# Altium project PCB_Project.PrjPcb (part 1 of 4)
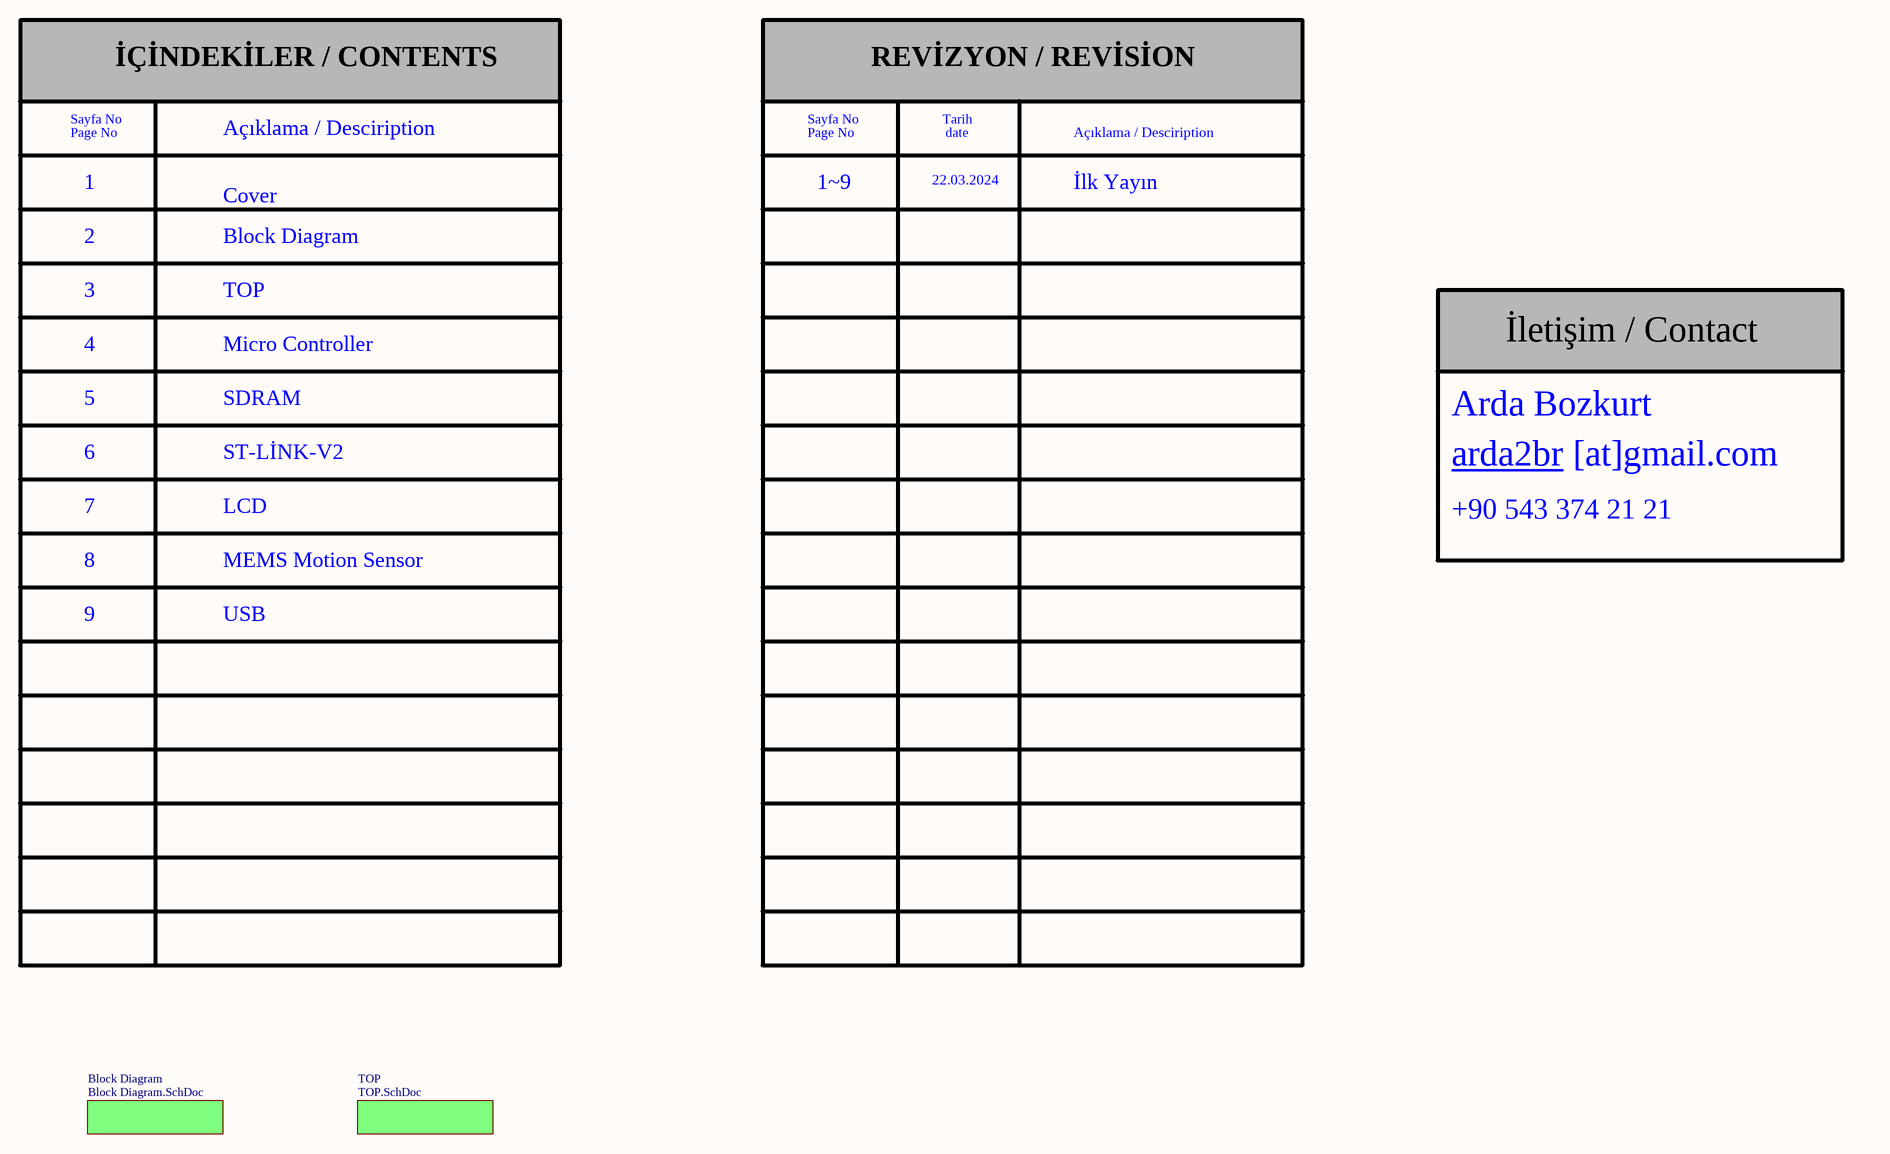
[diagram p0: Cover Page.SchDoc]
9 sheets, 161 parts. Net scope: flat (ports and power ports of the same name join across sheets).
Board file: STM PCB.PcbDoc
Sheets:
  Cover Page.SchDoc
    Block Diagram = Block Diagram.SchDoc
    TOP = TOP.SchDoc
      MCU = Micro Controller.SchDoc
      SDRAM = SDRAM.SchDoc
      ST-LINK = ST-LINK.SchDoc
      LCD = LCD.SchDoc
      MEMS = MEMS Motion Sensor.SchDoc
      USB = USB.SchDoc

## Sheet Cover Page.SchDoc
size 420 x 297 mm; Date: 22.03.2024; ApprovedBy: Arda B.; CheckedBy: Arda B.; DrawnBy: Arda Bozkurt; Revision: 001; SheetNumber: 1; SheetTotal: 9; Size: A3; Department: HDD; DOC_NO_ASSY_: __; Time: 22.03.2024

### Sub-sheets
Block Diagram = Block Diagram.SchDoc: no entries
TOP = TOP.SchDoc: no entries

### Notes on the sheet
- İÇİNDEKİLER / CONTENTS
- REVİZYON / REVİSİON
- Page No
- Sayfa No
- Açıklama / Desciription
- 22.03.2024
- Tarih
- date
- 1
- 2
- Cover
- Block Diagram
- 1~9
- İlk Yayın
- 3
- TOP
- 4
- Micro Controller
- İletişim / Contact
- 5
- SDRAM
- Arda Bozkurt
- 6
- 7
- ST-LİNK-V2
- LCD
- arda2br
- [at]gmail.com
- 8
- MEMS Motion Sensor
- +90 543 374 21 21
- 9
- USB
- REVİSİON
- DESCRIPTION
- DATE
- APPROVED
- DWG NO:
- TAINIM/DESCRIPTION
- REV:
- DOSYA ADI/FİLE NAME
- HAZIRLAYAN/PREPARED BY
- KONTROL EDEN/ CHECKED BY
- YAYIN TARİHİ/REL. DATE
- DEĞ TARİHİ/CHANCE DATE
- ONAYLAYAN/APPROVED BY
- REVİZYON/REVISION
- BÖLÜM/DEPARTMENT
- BOYUT/SİZE
- SAYFA/SHEET
- of

## Sheet Block Diagram.SchDoc
size 420 x 297 mm; Date: 22.03.2024; ApprovedBy: Arda B.; CheckedBy: Arda B.; DrawnBy: Arda Bozkurt; Revision: 001; SheetNumber: 2; SheetTotal: 9; Size: A3; Department: HDD; DOC_NO_ASSY_: __; Time: 22.03.2024
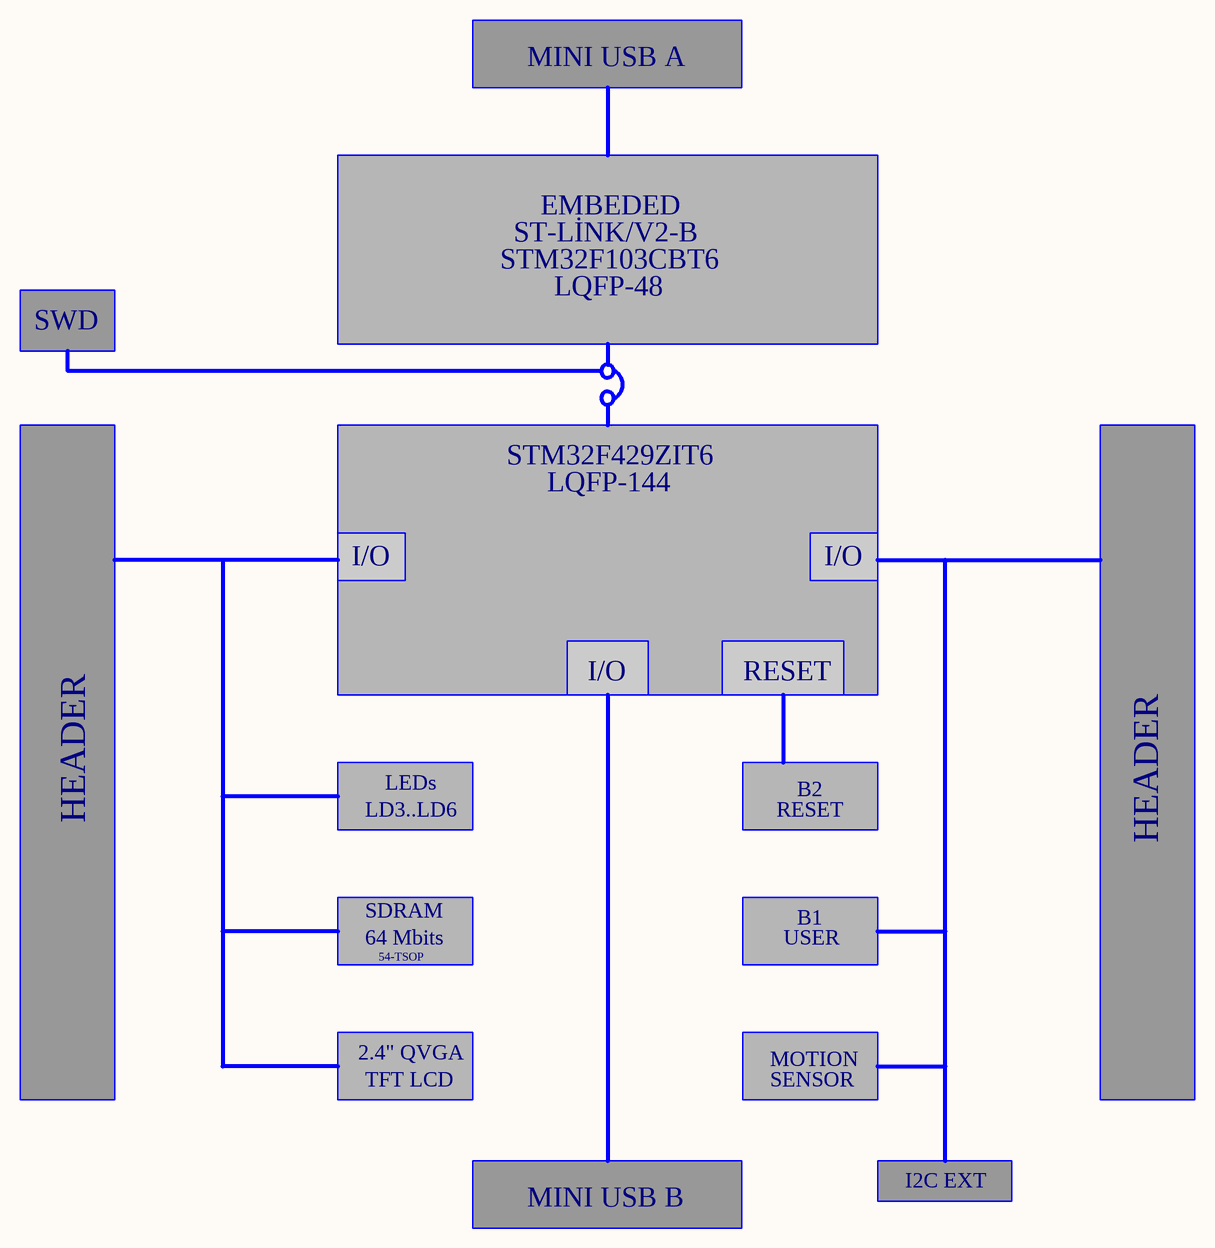
[diagram p1: Block Diagram.SchDoc]

### Notes on the sheet
- MINI USB A
- ST-LİNK/V2-B
- EMBEDED
- STM32F103CBT6
- LQFP-48
- SWD
- STM32F429ZIT6
- LQFP-144
- I/O
- RESET
- HEADER
- LD3..LD6
- LEDs
- B2
- SDRAM
- 64 Mbits
- 54-TSOP
- USER
- B1
- 2.4" QVGA
- TFT LCD
- MOTION
- SENSOR
- I2C EXT
- MINI USB B
- REVİSİON
- DESCRIPTION
- DATE
- APPROVED
- DWG NO:
- TAINIM/DESCRIPTION
- REV:
- DOSYA ADI/FİLE NAME
- HAZIRLAYAN/PREPARED BY
- KONTROL EDEN/ CHECKED BY
- YAYIN TARİHİ/REL. DATE
- DEĞ TARİHİ/CHANCE DATE
- ONAYLAYAN/APPROVED BY
- REVİZYON/REVISION
- Arda Bozkurt
- BÖLÜM/DEPARTMENT
- BOYUT/SİZE
- SAYFA/SHEET
- of

## Sheet TOP.SchDoc
size 420 x 297 mm; Date: 22.03.2024; ApprovedBy: Arda B.; CheckedBy: Arda B.; DrawnBy: Arda Bozkurt; Revision: 001; SheetNumber: 3; SheetTotal: 9; Size: A3; Department: HDD; DOC_NO_ASSY_: __; Time: 22.03.2024
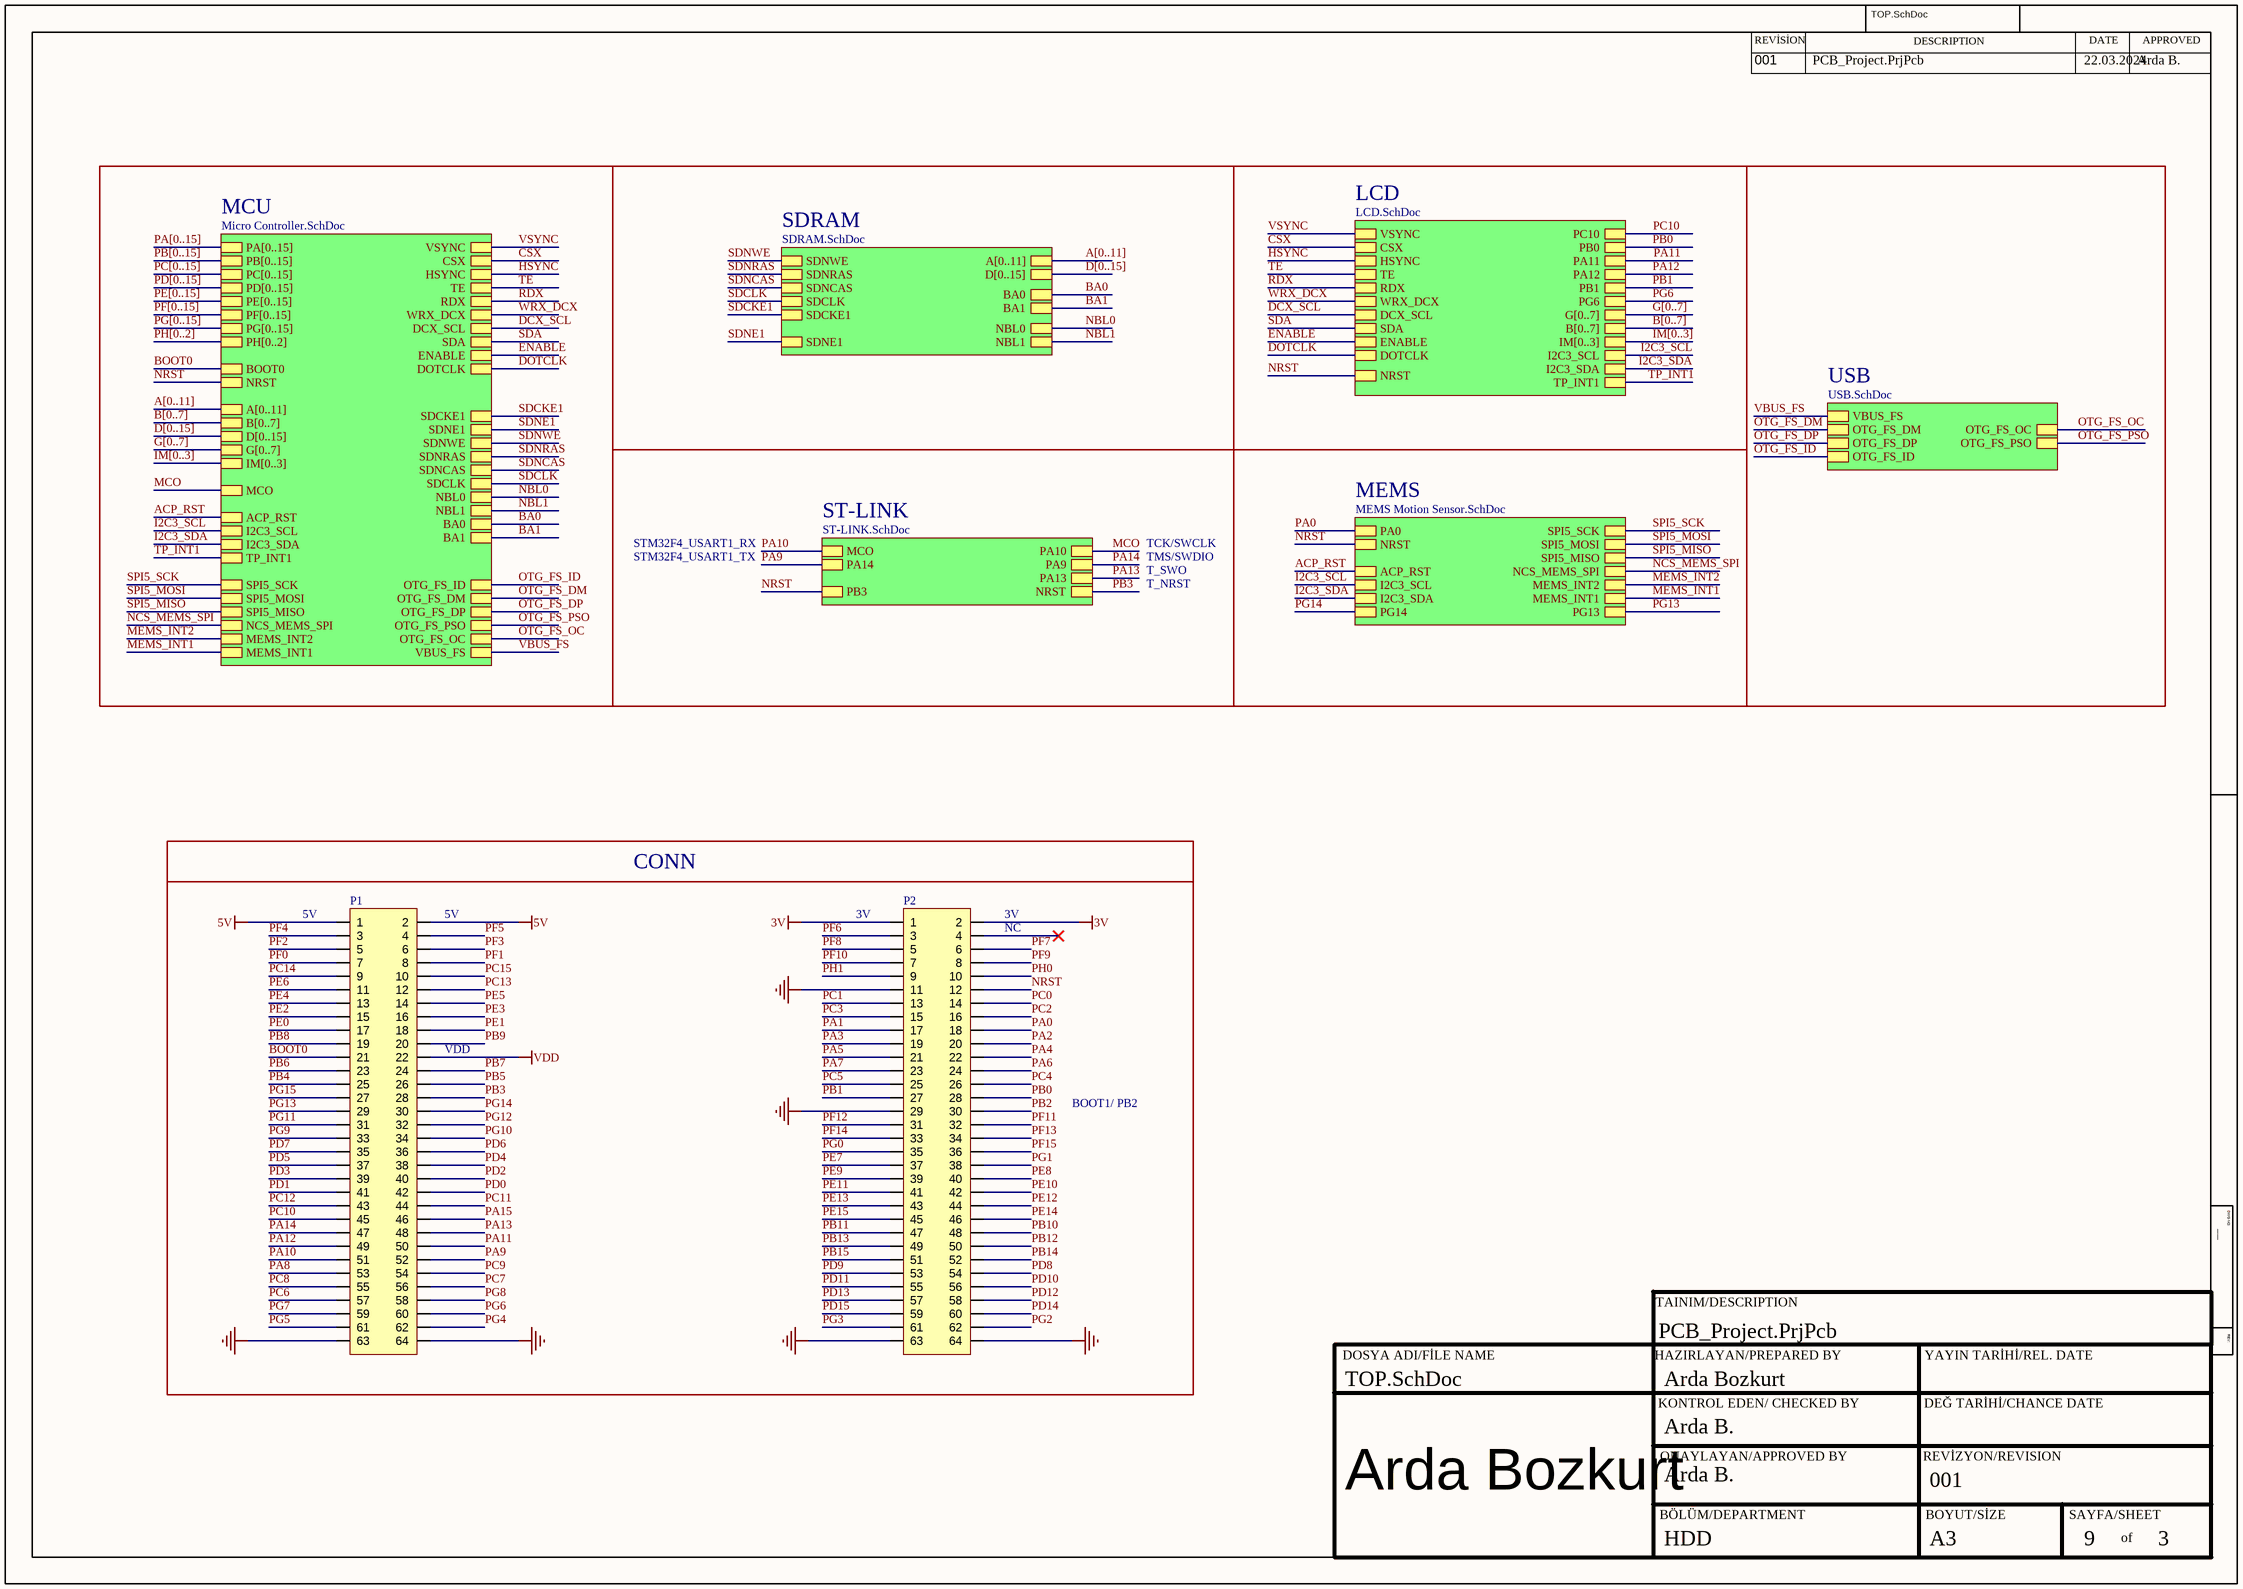
[diagram p2: TOP.SchDoc]

### Parts
P1  TSW-132-24-T-D  [CONN-2*32POS]  (value not drawn)
P2  TSW-132-24-T-D  [CONN-2*32POS]  (value not drawn)

### Blocks framed on the sheet
CONN: P1 P2

### Sub-sheets
LCD = LCD.SchDoc: PC10, PB0, PA11, PA12, PB1, PG6, G[0..7], B[0..7], IM[0..3], I2C3_SCL, I2C3_SDA, TP_INT1, NRST, VSYNC, CSX, HSYNC, TE, RDX, WRX_DCX, DCX_SCL, SDA, ENABLE, DOTCLK
MCU = Micro Controller.SchDoc: PA[0..15], PB[0..15], PC[0..15], PD[0..15], PE[0..15], PF[0..15], PG[0..15], PH[0..2], BOOT0, NRST, A[0..11], B[0..7], D[0..15], G[0..7], IM[0..3], MCO, ACP_RST, I2C3_SCL, I2C3_SDA, TP_INT1, VSYNC, CSX, HSYNC, TE, RDX, WRX_DCX, DCX_SCL, SDA, ENABLE, DOTCLK, SDCKE1, SDNE1, SDNWE, SDNRAS, SDNCAS, SDCLK, NBL0, NBL1, BA0, BA1, OTG_FS_ID, OTG_FS_DM, OTG_FS_DP, OTG_FS_PSO, OTG_FS_OC, VBUS_FS, SPI5_SCK, SPI5_MOSI, SPI5_MISO, NCS_MEMS_SPI, MEMS_INT2, MEMS_INT1
MEMS = MEMS Motion Sensor.SchDoc: PG13, PA0, NRST, PG14, SPI5_SCK, SPI5_MOSI, SPI5_MISO, NCS_MEMS_SPI, MEMS_INT2, MEMS_INT1, ACP_RST, I2C3_SCL, I2C3_SDA
SDRAM = SDRAM.SchDoc: SDCKE1, SDNE1, SDNWE, SDNRAS, SDNCAS, SDCLK, NBL0, NBL1, BA0, BA1, A[0..11], D[0..15]
ST-LINK = ST-LINK.SchDoc: PA10, PA9, MCO, PA14, PA13, PB3, NRST
USB = USB.SchDoc: VBUS_FS, OTG_FS_DM, OTG_FS_DP, OTG_FS_ID, OTG_FS_OC, OTG_FS_PSO

### Nets
3V: P2.1 P2.2
5V: P1.1 P1.2
GND: P1.63 P1.64 P2.11 P2.29 P2.63 P2.64
VDD: P1.22
ACP_RST: sheet MCU/ACP_RST, sheet MEMS/ACP_RST
BA0: sheet MCU/BA0, sheet SDRAM/BA0
BA1: sheet MCU/BA1, sheet SDRAM/BA1
BOOT0: P1.21 ; sheet MCU/BOOT0
CSX: sheet MCU/CSX, sheet LCD/CSX
DCX_SCL: sheet MCU/DCX_SCL, sheet LCD/DCX_SCL
DOTCLK: sheet MCU/DOTCLK, sheet LCD/DOTCLK
ENABLE: sheet MCU/ENABLE, sheet LCD/ENABLE
HSYNC: sheet MCU/HSYNC, sheet LCD/HSYNC
I2C3_SCL: sheet MCU/I2C3_SCL, sheet LCD/I2C3_SCL, sheet MEMS/I2C3_SCL
I2C3_SDA: sheet MCU/I2C3_SDA, sheet LCD/I2C3_SDA, sheet MEMS/I2C3_SDA
MCO: sheet MCU/MCO, sheet ST-LINK/PA10
MEMS_INT1: sheet MCU/MEMS_INT1, sheet MEMS/MEMS_INT1
MEMS_INT2: sheet MCU/MEMS_INT2, sheet MEMS/MEMS_INT2
NBL0: sheet MCU/NBL0, sheet SDRAM/NBL0
NBL1: sheet MCU/NBL1, sheet SDRAM/NBL1
NCS_MEMS_SPI: sheet MCU/NCS_MEMS_SPI, sheet MEMS/NCS_MEMS_SPI
NRST: P2.12 ; sheet MCU/NRST, sheet ST-LINK/PB3, sheet LCD/NRST, sheet MEMS/NRST
OTG_FS_DM: sheet MCU/OTG_FS_DM, sheet USB/OTG_FS_DM
OTG_FS_DP: sheet MCU/OTG_FS_DP, sheet USB/OTG_FS_DP
OTG_FS_ID: sheet MCU/OTG_FS_ID, sheet USB/OTG_FS_ID
OTG_FS_OC: sheet MCU/OTG_FS_OC, sheet USB/OTG_FS_OC
OTG_FS_PSO: sheet MCU/OTG_FS_PSO, sheet USB/OTG_FS_PSO
PA0: P2.18 ; sheet MEMS/PA0
PA1: P2.17
PA2: P2.20
PA3: P2.19
PA4: P2.22
PA5: P2.21
PA6: P2.24
PA7: P2.23
PA8: P1.53
PA9: P1.52 ; sheet ST-LINK/PA14
PA10: P1.51 ; sheet ST-LINK/MCO
PA11: P1.50 ; sheet LCD/PA11
PA12: P1.49 ; sheet LCD/PA12
PA13: P1.48 ; sheet ST-LINK/PA13
PA14: P1.47 ; sheet ST-LINK/PA9
PA15: P1.46
PB0: P2.28 ; sheet LCD/PB0
PB1: P2.27 ; sheet LCD/PB1
PB2: P2.30
PB3: P1.28 ; sheet ST-LINK/NRST
PB4: P1.25
PB5: P1.26
PB6: P1.23
PB7: P1.24
PB8: P1.19
PB9: P1.20
PB10: P2.48
PB11: P2.47
PB12: P2.50
PB13: P2.49
PB14: P2.52
PB15: P2.51
PC0: P2.14
PC1: P2.13
PC2: P2.16
PC3: P2.15
PC4: P2.26
PC5: P2.25
PC6: P1.57
PC7: P1.56
PC8: P1.55
PC9: P1.54
PC10: P1.45 ; sheet LCD/PC10
PC11: P1.44
PC12: P1.43
PC13: P1.12
PC14: P1.9
PC15: P1.10
PD0: P1.42
PD1: P1.41
PD2: P1.40
PD3: P1.39
PD4: P1.38
PD5: P1.37
PD6: P1.36
PD7: P1.35
PD8: P2.54
PD9: P2.53
PD10: P2.56
PD11: P2.55
PD12: P2.58
PD13: P2.57
PD14: P2.60
PD15: P2.59
PE0: P1.17
PE1: P1.18
PE2: P1.15
PE3: P1.16
PE4: P1.13
PE5: P1.14
PE6: P1.11
PE7: P2.37
PE8: P2.40
PE9: P2.39
PE10: P2.42
PE11: P2.41
PE12: P2.44
PE13: P2.43
PE14: P2.46
PE15: P2.45
PF0: P1.7
PF1: P1.8
PF2: P1.5
PF3: P1.6
PF4: P1.3
PF5: P1.4
PF6: P2.3
PF7: P2.6
PF8: P2.5
PF9: P2.8
PF10: P2.7
PF11: P2.32
PF12: P2.31
PF13: P2.34
PF14: P2.33
PF15: P2.36
PG0: P2.35
PG1: P2.38
PG2: P2.62
PG3: P2.61
PG4: P1.62
PG5: P1.61
PG6: P1.60 ; sheet LCD/PG6
PG7: P1.59
PG8: P1.58
PG9: P1.33
PG10: P1.34
PG11: P1.31
PG12: P1.32
PG13: P1.29 ; sheet MEMS/PG13
PG14: P1.30 ; sheet MEMS/PG14
PG15: P1.27
PH0: P2.10
PH1: P2.9
RDX: sheet MCU/RDX, sheet LCD/RDX
SDA: sheet MCU/SDA, sheet LCD/SDA
SDCKE1: sheet MCU/SDCKE1, sheet SDRAM/SDCKE1
SDCLK: sheet MCU/SDCLK, sheet SDRAM/SDCLK
SDNCAS: sheet MCU/SDNCAS, sheet SDRAM/SDNCAS
SDNE1: sheet MCU/SDNE1, sheet SDRAM/SDNE1
SDNRAS: sheet MCU/SDNRAS, sheet SDRAM/SDNRAS
SDNWE: sheet MCU/SDNWE, sheet SDRAM/SDNWE
SPI5_MISO: sheet MCU/SPI5_MISO, sheet MEMS/SPI5_MISO
SPI5_MOSI: sheet MCU/SPI5_MOSI, sheet MEMS/SPI5_MOSI
SPI5_SCK: sheet MCU/SPI5_SCK, sheet MEMS/SPI5_SCK
TE: sheet MCU/TE, sheet LCD/TE
TP_INT1: sheet MCU/TP_INT1, sheet LCD/TP_INT1
VBUS_FS: sheet MCU/VBUS_FS, sheet USB/VBUS_FS
VSYNC: sheet MCU/VSYNC, sheet LCD/VSYNC
WRX_DCX: sheet MCU/WRX_DCX, sheet LCD/WRX_DCX

Not connected (* = marked no-connect by the designer): P2 4*

### Buses and harness runs
bus A[0..11] = sheet MCU/A[0..11]
bus A[0..11] = sheet SDRAM/A[0..11]
bus B[0..7] = sheet LCD/B[0..7]
bus B[0..7] = sheet MCU/B[0..7]
bus D[0..15] = sheet MCU/D[0..15]
bus D[0..15] = sheet SDRAM/D[0..15]
bus G[0..7] = sheet LCD/G[0..7]
bus G[0..7] = sheet MCU/G[0..7]
bus IM[0..3] = sheet LCD/IM[0..3]
bus IM[0..3] = sheet MCU/IM[0..3]
bus PA[0..15] = sheet MCU/PA[0..15]
bus PB[0..15] = sheet MCU/PB[0..15]
bus PC[0..15] = sheet MCU/PC[0..15]
bus PD[0..15] = sheet MCU/PD[0..15]
bus PE[0..15] = sheet MCU/PE[0..15]
bus PF[0..15] = sheet MCU/PF[0..15]
bus PG[0..15] = sheet MCU/PG[0..15]
bus PH[0..2] = sheet MCU/PH[0..2]

### Notes on the sheet
- STM32F4_USART1_TX
- STM32F4_USART1_RX
- TCK/SWCLK
- TMS/SWDIO
- T_SWO
- T_NRST
- (near P1) 5V
- (near P2) 3V
- (near P2) NC
- (near P1) VDD
- BOOT1/ PB2
- REVİSİON
- DESCRIPTION
- DATE
- APPROVED
- DWG NO:
- TAINIM/DESCRIPTION
- REV:
- DOSYA ADI/FİLE NAME
- HAZIRLAYAN/PREPARED BY
- KONTROL EDEN/ CHECKED BY
- YAYIN TARİHİ/REL. DATE
- DEĞ TARİHİ/CHANCE DATE
- ONAYLAYAN/APPROVED BY
- REVİZYON/REVISION
- Arda Bozkurt
- BÖLÜM/DEPARTMENT
- BOYUT/SİZE
- SAYFA/SHEET
- of

### Library data of the parts
P1 P2 = CONN HEADER VERT 32POS 2.54MM: Headers & Wire Housings Classic PCB Header Strips, 0.100 pitch; Manufacturer: Wurth Electronics; Manufacturer Part Number: 61303221121; Operating Supply Voltage: 250V; Contact Resistance: 20mR; Current Rating: 3A; Gender: 29Gender; Supplier: Farnell; Supplier Part Number: 2356145; RoHS: Yes; Category: Connectors; Stock: 745; Pricing: 1=1,75, 10=0,941, 100=0,855, 500=0,778, 1000=0,762, 2500=0,747 (EUR); Orientation: 5495OrientationType; ComponentLink1URL: https://datasheet.ciiva.com/28505/1442180-28505766.pdf?src-supplier=Element14; ComponentLink1Description: https://datasheet.ciiva.com/28505/1442180-28505766.pdf?src-supplier=Element14; ComponentLink2URL: https://datasheet.ciiva.com/48557/htsw-th-48557319.pdf?src-supplier=Avnet; ComponentLink2Description: https://datasheet.ciiva.com/48557/htsw-th-48557319.pdf?src-supplier=Avnet

## Sheet Micro Controller.SchDoc
size 420 x 297 mm; Date: 22.03.2024; ApprovedBy: Arda B.; CheckedBy: Arda B.; DrawnBy: Arda Bozkurt; Revision: 001; SheetNumber: 4; SheetTotal: 9; Size: A3; Department: HDD; DOC_NO_ASSY_: __; Time: 22.03.2024
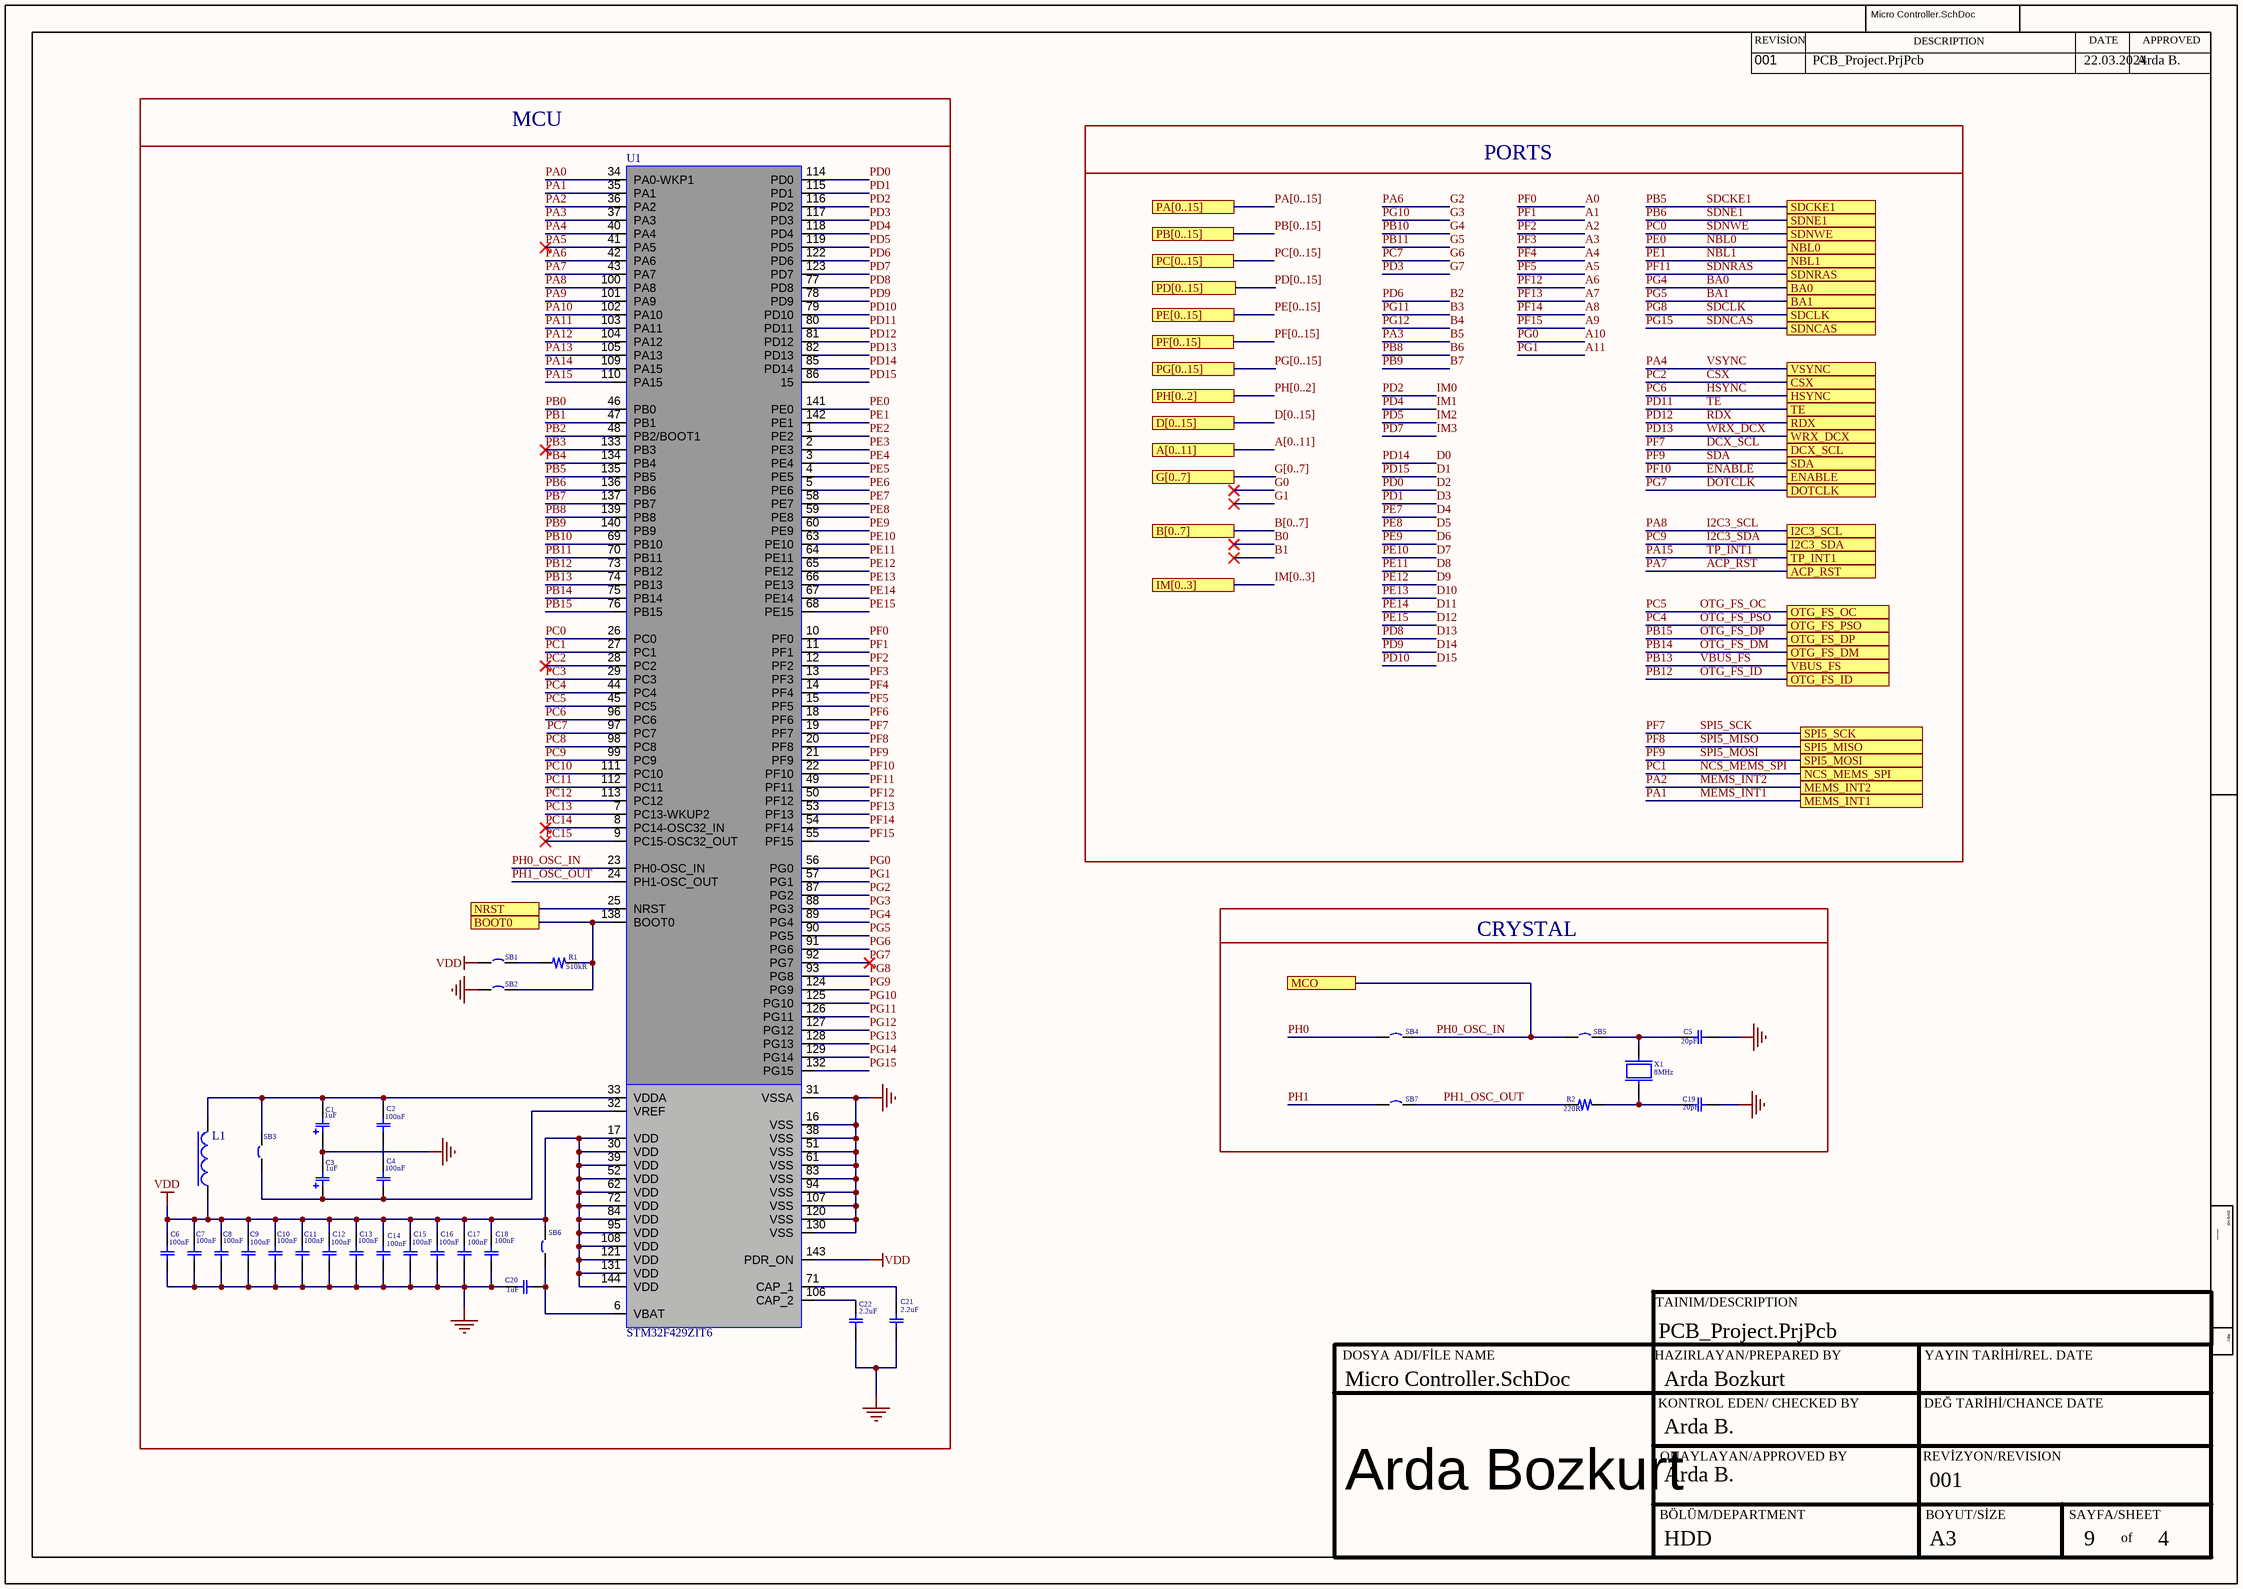
[diagram p3: Micro Controller.SchDoc]

### Parts
C1  value 1uF  [CAP-TANT]  (hidden comment: TAJA105K016RNJ)
C2  value 100nF  [CAP-0402]  (hidden comment: CC0402KRX7R7BB104)
C3  value 1uF  [CAP-TANT]  (hidden comment: TAJA105K016RNJ)
C4  value 100nF  [CAP-0402]  (hidden comment: CC0402KRX7R7BB104)
C5  value 20pF  [CAP-0402]  (hidden comment: CC0402JRNPO9BN200)
C6  value 100nF  [CAP-0402]  (hidden comment: CC0402KRX7R7BB104)
C7  value 100nF  [CAP-0402]  (hidden comment: CC0402KRX7R7BB104)
C8  value 100nF  [CAP-0402]  (hidden comment: CC0402KRX7R7BB104)
C9  value 100nF  [CAP-0402]  (hidden comment: CC0402KRX7R7BB104)
C10  value 100nF  [CAP-0402]  (hidden comment: CC0402KRX7R7BB104)
C11  value 100nF  [CAP-0402]  (hidden comment: CC0402KRX7R7BB104)
C12  value 100nF  [CAP-0402]  (hidden comment: CC0402KRX7R7BB104)
C13  value 100nF  [CAP-0402]  (hidden comment: CC0402KRX7R7BB104)
C14  value 100nF  [CAP-0402]  (hidden comment: CC0402KRX7R7BB104)
C15  value 100nF  [CAP-0402]  (hidden comment: CC0402KRX7R7BB104)
C16  value 100nF  [CAP-0402]  (hidden comment: CC0402KRX7R7BB104)
C17  value 100nF  [CAP-0402]  (hidden comment: CC0402KRX7R7BB104)
C18  value 100nF  [CAP-0402]  (hidden comment: CC0402KRX7R7BB104)
C19  value 20pF  [CAP-0402]  (hidden comment: CC0402JRNPO9BN200)
C20  value 1uF  [CAP-0603]  (hidden comment: CC0603KRX5R8BB105)
C21  value 2.2uF  [CAP-1206]  (hidden comment: CC1206KKX7R7BB225)
C22  value 2.2uF  [CAP-1206]  (hidden comment: CC1206KKX7R7BB225)
L1  FCM 1608KF-301T05  [FB-0603]  (value not drawn)
R1  value 510kR  [RES-0402]  (hidden comment: RC0402FR-07510KL)
R2  value 220R  [RES-0402]  (hidden comment: RC0402FR-07220RL)
SB1  RC0402JR-070RL  [RES-0402]  (value not drawn)
SB2  RC0402JR-070RL  [RES-0402]  (value not drawn)
SB3  RC0402JR-070RL  [RES-0402]  (value not drawn)
SB4  RC0402JR-070RL  [RES-0402]  (value not drawn)
SB5  RC0402JR-070RL  [RES-0402]  (value not drawn)
SB6  RC0402JR-070RL  [RES-0402]  (value not drawn)
SB7  RC0402JR-070RL  [RES-0402]  (value not drawn)
U1  STM32F429ZIT6  [LQFP-144]
X1  Frequency: 8MHz  [HC-49US]  (hidden comment: H1OED8K5SC-112YXC-8M)

### Ports
A[0..11] (see TOP[1B], SDRAM[4B]), ACP_RST (see TOP[1B], MEMS Motion Sensor[5B]), B[0..7] (see TOP[1B], LCD[3C]), BA0 (see TOP[2B], SDRAM[2B]), BA1 (see TOP[2B], SDRAM[2B]), BOOT0 (see TOP[1A]), CSX (see TOP[2A], LCD[2C]), D[0..15] (see TOP[1B], SDRAM[4B]), DCX_SCL (see TOP[2A], LCD[2C]), DOTCLK (see TOP[2A], LCD[2C]), ENABLE (see TOP[2A], LCD[2C]), G[0..7] (see TOP[1B], LCD[3C]), HSYNC (see TOP[2A], LCD[2C]), I2C3_SCL (see TOP[1B], LCD[4B], MEMS Motion Sensor[4B]), I2C3_SDA (see TOP[1B], LCD[4B], MEMS Motion Sensor[4B]), IM[0..3] (see TOP[1B], LCD[3C]), MCO (see TOP[1B]), MEMS_INT1 (see TOP[1B], MEMS Motion Sensor[1B]), MEMS_INT2 (see TOP[1B], MEMS Motion Sensor[1B]), NBL0 (see TOP[2B], SDRAM[3C]), NBL1 (see TOP[2B], SDRAM[3C]), NCS_MEMS_SPI (see TOP[1B], MEMS Motion Sensor[1B]), NRST (see TOP[1A], LCD[1B], MEMS Motion Sensor[3C]), OTG_FS_DM (see TOP[2B], USB[2B]), OTG_FS_DP (see TOP[2B], USB[2B]), OTG_FS_ID (see TOP[2B], USB[2B]), OTG_FS_OC (see TOP[2B], USB[4B]), OTG_FS_PSO (see TOP[2B], USB[2B]), PA[0..15] (see TOP[1A], LCD[3B], MEMS Motion Sensor[5C], ST-LINK[2C], ST-LINK[3A]), PB[0..15] (see TOP[1A], LCD[3B]), PC[0..15] (see TOP[1A], LCD[3B]), PD[0..15] (see TOP[1A]), PE[0..15] (see TOP[1A]), PF[0..15] (see TOP[1A]), PG[0..15] (see TOP[1A], LCD[3B], MEMS Motion Sensor[2C]), PH[0..2] (see TOP[1A]), RDX (see TOP[2A], LCD[2C]), SDA (see TOP[2A], LCD[2C]), SDCKE1 (see TOP[2B], SDRAM[2C]), SDCLK (see TOP[2B], SDRAM[2C]), SDNCAS (see TOP[2B], SDRAM[2C]), SDNE1 (see TOP[2B], SDRAM[2B]), SDNRAS (see TOP[2B], SDRAM[2C]), SDNWE (see TOP[2B], SDRAM[2C]), SPI5_MISO (see TOP[1B], MEMS Motion Sensor[1B]), SPI5_MOSI (see TOP[1B], MEMS Motion Sensor[1B]), SPI5_SCK (see TOP[1B], MEMS Motion Sensor[1B]), TE (see TOP[2A], LCD[2C]), TP_INT1 (see TOP[1B], LCD[4B]), VBUS_FS (see TOP[2B], USB[2B]), VSYNC (see TOP[2A], LCD[2C]), WRX_DCX (see TOP[2A], LCD[2C])

### Nets
GND: C1.1 C3.2 C5.2 C6.1 C7.1 C8.1 C9.1 C10.1 C11.1 C12.1 C13.1 C14.1 C15.1 C16.1 C17.1 C18.1 C19.2 C20.1 C21.1 C22.1 SB2.1 U1.16(VSS) U1.31(VSSA) U1.38(VSS) U1.51(VSS) U1.61(VSS) U1.83(VSS) U1.94(VSS) U1.107(VSS) U1.120(VSS) U1.130(VSS)
VDD: C6.2 C7.2 C8.2 C9.2 C10.2 C11.2 C12.2 C13.2 C14.2 C15.2 C16.2 C17.2 C18.2 L1.1 SB1.1 SB6.2 U1.17(VDD) U1.30(VDD) U1.39(VDD) U1.52(VDD) U1.62(VDD) U1.72(VDD) U1.84(VDD) U1.95(VDD) U1.108(VDD) U1.121(VDD) U1.131(VDD) U1.143(PDR_ON) U1.144(VDD)
A0: U1.10(PF0)  [also labelled PF0]
A1: U1.11(PF1)  [also labelled PF1]
A2: U1.12(PF2)  [also labelled PF2]
A3: U1.13(PF3)  [also labelled PF3]
A4: U1.14(PF4)  [also labelled PF4]
A5: U1.15(PF5)  [also labelled PF5]
A6: U1.50(PF12)  [also labelled PF12]
A7: U1.53(PF13)  [also labelled PF13]
A8: U1.54(PF14)  [also labelled PF14]
A9: U1.55(PF15)  [also labelled PF15]
A10: U1.56(PG0)  [also labelled PG0]
A11: U1.57(PG1)  [also labelled PG1]
ACP_RST: U1.43(PA7) ; port ACP_RST  [also labelled PA7]
B2: U1.122(PD6)  [also labelled PD6]
B3: U1.126(PG11)  [also labelled PG11]
B4: U1.127(PG12)  [also labelled PG12]
B5: U1.37(PA3)  [also labelled PA3]
B6: U1.139(PB8)  [also labelled PB8]
B7: U1.140(PB9)  [also labelled PB9]
BA0: U1.89(PG4) ; port BA0  [also labelled PG4]
BA1: U1.90(PG5) ; port BA1  [also labelled PG5]
CSX: U1.28(PC2) ; port CSX  [also labelled PC2]
D0: U1.85(PD14)  [also labelled PD14]
D1: U1.86(15)  [also labelled PD15]
D2: U1.114(PD0)  [also labelled PD0]
D3: U1.115(PD1)  [also labelled PD1]
D4: U1.58(PE7)  [also labelled PE7]
D5: U1.59(PE8)  [also labelled PE8]
D6: U1.60(PE9)  [also labelled PE9]
D7: U1.63(PE10)  [also labelled PE10]
D8: U1.64(PE11)  [also labelled PE11]
D9: U1.65(PE12)  [also labelled PE12]
D10: U1.66(PE13)  [also labelled PE13]
D11: U1.67(PE14)  [also labelled PE14]
D12: U1.68(PE15)  [also labelled PE15]
D13: U1.77(PD8)  [also labelled PD8]
D14: U1.78(PD9)  [also labelled PD9]
D15: U1.79(PD10)  [also labelled PD10]
DCX_SCL: U1.19(PF7) ; port DCX_SCL, port SPI5_SCK  [also labelled PF7, SPI5_SCK]
DOTCLK: U1.92(PG7) ; port DOTCLK  [also labelled PG7]
ENABLE: U1.22(PF10) ; port ENABLE  [also labelled PF10]
G2: U1.42(PA6)  [also labelled PA6]
G3: U1.125(PG10)  [also labelled PG10]
G4: U1.69(PB10)  [also labelled PB10]
G5: U1.70(PB11)  [also labelled PB11]
G6: U1.97(PC7)  [also labelled PC7]
G7: U1.117(PD3)  [also labelled PD3]
HSYNC: U1.96(PC6) ; port HSYNC  [also labelled PC6]
I2C3_SCL: U1.100(PA8) ; port I2C3_SCL  [also labelled PA8]
I2C3_SDA: U1.99(PC9) ; port I2C3_SDA  [also labelled PC9]
IM0: U1.116(PD2)  [also labelled PD2]
IM1: U1.118(PD4)  [also labelled PD4]
IM2: U1.119(PD5)  [also labelled PD5]
IM3: U1.123(PD7)  [also labelled PD7]
MEMS_INT1: U1.35(PA1) ; port MEMS_INT1  [also labelled PA1]
MEMS_INT2: U1.36(PA2) ; port MEMS_INT2  [also labelled PA2]
NBL0: U1.141(PE0) ; port NBL0  [also labelled PE0]
NBL1: U1.142(PE1) ; port NBL1  [also labelled PE1]
NCS_MEMS_SPI: U1.27(PC1) ; port NCS_MEMS_SPI  [also labelled PC1]
NRST: U1.25(NRST) ; port NRST
OTG_FS_DM: U1.75(PB14) ; port OTG_FS_DM  [also labelled PB14]
OTG_FS_DP: U1.76(PB15) ; port OTG_FS_DP  [also labelled PB15]
OTG_FS_ID: U1.73(PB12) ; port OTG_FS_ID  [also labelled PB12]
OTG_FS_OC: U1.45(PC5) ; port OTG_FS_OC  [also labelled PC5]
OTG_FS_PSO: U1.44(PC4) ; port OTG_FS_PSO  [also labelled PC4]
PA0: U1.34(PA0-WKP1)
PA4: U1.40(PA4) ; port VSYNC  [also labelled VSYNC]
PA5: U1.41(PA5)
PA9: U1.101(PA9)
PA10: U1.102(PA10)
PA11: U1.103(PA11)
PA12: U1.104(PA12)
PA13: U1.105(PA13)
PA14: U1.109(PA15)
PA15: U1.110(PA15) ; port TP_INT1  [also labelled TP_INT1]
PB0: U1.46(PB0)
PB1: U1.47(PB1)
PB2: U1.48(PB2/BOOT1)
PB3: U1.133(PB3)
PB4: U1.134(PB4)
PB5: U1.135(PB5) ; port SDCKE1  [also labelled SDCKE1]
PB6: U1.136(PB6) ; port SDNE1  [also labelled SDNE1]
PB7: U1.137(PB7)
PB13: U1.74(PB13) ; port VBUS_FS  [also labelled VBUS_FS]
PC0: U1.26(PC0) ; port SDNWE  [also labelled SDNWE]
PC3: U1.29(PC3)
PC8: U1.98(PC8)
PC10: U1.111(PC10)
PC11: U1.112(PC11)
PC12: U1.113(PC12)
PC13: U1.7(PC13-WKUP2)
PC14: U1.8(PC14-OSC32_IN)
PC15: U1.9(PC15-OSC32_OUT)
PD11: U1.80(PD11) ; port TE  [also labelled TE]
PD12: U1.81(PD12) ; port RDX  [also labelled RDX]
PD13: U1.82(PD13) ; port WRX_DCX  [also labelled WRX_DCX]
PE2: U1.1(PE2)
PE3: U1.2(PE3)
PE4: U1.3(PE4)
PE5: U1.4(PE5)
PE6: U1.5(PE6)
PF6: U1.18(PF6)
PF8: U1.20(PF8) ; port SPI5_MISO  [also labelled SPI5_MISO]
PF9: U1.21(PF9) ; port SDA, port SPI5_MOSI  [also labelled SDA, SPI5_MOSI]
PF11: U1.49(PF11) ; port SDNRAS  [also labelled SDNRAS]
PG2: U1.87(PG2)
PG3: U1.88(PG3)
PG6: U1.91(PG6)
PG8: U1.93(PG8) ; port SDCLK  [also labelled SDCLK]
PG9: U1.124(PG9)
PG13: U1.128(PG13)
PG14: U1.129(PG14)
PG15: U1.132(PG15) ; port SDNCAS  [also labelled SDNCAS]
PH0: SB4.1
PH0_OSC_IN: SB4.2 SB5.1 U1.23(PH0-OSC_IN) ; port MCO  [project net MCO]
PH1: SB7.1
PH1_OSC_OUT: R2.1 SB7.2 U1.24(PH1-OSC_OUT)
NetC1_2: C1.2 C2.2 L1.2 SB3.2 U1.33(VDDA)
NetC2_1: C2.1 C4.2
NetC3_1: C3.1 C4.1 SB3.1 U1.32(VREF)
NetC5_1: C5.1 SB5.2 X1.2
NetC19_1: C19.1 R2.2 X1.1
NetC20_2: C20.2 SB6.1 U1.6(VBAT)
NetC21_2: C21.2 U1.71(CAP_1)
NetC22_2: C22.2 U1.106(CAP_2)
NetR1_1: R1.1 SB1.2
NetR1_2: R1.2 SB2.2 U1.138(BOOT0) ; port BOOT0

### Buses and harness runs
bus A[0..11] = port A[0..11]
bus B[0..7] = port B[0..7]
bus D[0..15] = port D[0..15]
bus G[0..7] = port G[0..7]
bus IM[0..3] = port IM[0..3]
bus PA[0..15] = port PA[0..15]
bus PB[0..15] = port PB[0..15]
bus PC[0..15] = port PC[0..15]
bus PD[0..15] = port PD[0..15]
bus PE[0..15] = port PE[0..15]
bus PF[0..15] = port PF[0..15]
bus PG[0..15] = port PG[0..15]
bus PH[0..2] = port PH[0..2]

### Notes on the sheet
- MCU
- PORTS
- CRYSTAL
- REVİSİON
- DESCRIPTION
- DATE
- APPROVED
- DWG NO:
- TAINIM/DESCRIPTION
- REV:
- DOSYA ADI/FİLE NAME
- HAZIRLAYAN/PREPARED BY
- KONTROL EDEN/ CHECKED BY
- YAYIN TARİHİ/REL. DATE
- DEĞ TARİHİ/CHANCE DATE
- ONAYLAYAN/APPROVED BY
- REVİZYON/REVISION
- Arda Bozkurt
- BÖLÜM/DEPARTMENT
- BOYUT/SİZE
- SAYFA/SHEET
- of

### Library data of the parts
C1 C3 = C-TANT 1UF 10% 16V 1206: Cap Tant Solid 1uF 16V A CASE 10%( 3.2 X 1.6 X 1.6mm) Inward L SMD 3216-18 11 Ohm 125C T/R; Manufacturer: Kyocera AVX; Dielectric Material: Tantalum; Tolerance: 20%; ESR (Equivalent Series Resistance): 11R; Leakage Current: 500nA; Dissipation Factor: 4%; Supplier: Avnet; Supplier Part Number: TAJA105K016RNJ; Manufacturer Part Number: TAJA105K016RNJ; RoHS: Yes; Category: Tantalum Capacitors; Stock: 104000; Pricing: 2000=0,15379 (USD); Mounting Technology: Surface Mount,PCB; Case/Package: 1206; Pins: 2; Case Code (Metric): 3216; Case Code (Imperial): 1206; Weight: 0.000571oz; Min Operating Temperature: -55°C; Max Operating Temperature: 125°C; Voltage Rating (DC): 16V; Voltage Rating: 16V; Packaging: Tape and Reel; Features: General Purpose; Series: TAJ; Termination: SMD/SMT; Voltage: 16V; Length: 3.2mm; Width: 1.6mm; Height: 1.6mm; Depth: 1.6mm; Lead Pitch: 1.1mm; Reach SVHC Compliant: No; RoHS Compliant: Yes; ComponentLink1URL: https://datasheet.ciiva.com/18710/taj-eng-18710647.pdf?src-supplier=Distrelec; ComponentLink1Description: https://datasheet.ciiva.com/18710/taj-eng-18710647.pdf?src-supplier=Distrelec; ComponentLink2URL: https://datasheet.ciiva.com/7832/taj-7832811.pdf?src-supplier=Element14; ComponentLink2Description: https://datasheet.ciiva.com/7832/taj-7832811.pdf?src-supplier=Element14; ComponentLink3URL: https://datasheet.ciiva.com/7832/taj-7832810.pdf?src-supplier=Element14; ComponentLink3Description: https://datasheet.ciiva.com/7832/taj-7832810.pdf?src-supplier=Element14; ComponentLink4URL: https://datasheet.ciiva.com/7832/1680476-7832431.pdf?src-supplier=Element14; ComponentLink4Description: https://datasheet.ciiva.com/7832/1680476-7832431.pdf?src-supplier=Element14; ComponentLink5URL: https://datasheet.ciiva.com/263/taj-263410.pdf?src-supplier=Digikey; ComponentLink5Description: https://datasheet.ciiva.com/263/taj-263410.pdf?src-supplier=Digikey; ComponentLink6URL: https://datasheet.ciiva.com/263/taj-263409.pdf?src-supplier=Digikey; ComponentLink6Description: https://datasheet.ciiva.com/263/taj-263409.pdf?src-supplier=Digikey; ComponentLink7URL: https://datasheet.ciiva.com/263/taj-263411.pdf?src-supplier=Digikey; ComponentLink7Description: https://datasheet.ciiva.com/263/taj-263411.pdf?src-supplier=Digikey; ComponentLink8URL: https://datasheet.ciiva.com/7832/1703059-7832429.pdf?src-supplier=Element14; ComponentLink8Description: https://datasheet.ciiva.com/7832/1703059-7832429.pdf?src-supplier=Element14; ComponentLink9URL: https://datasheet.ciiva.com/7832/1703059-7832430.pdf?src-supplier=Element14; ComponentLink9Description: https://datasheet.ciiva.com/7832/1703059-7832430.pdf?src-supplier=Element14
C2 C4 C6-C18 = CAP CER 100nF 16V X7R 0402: Multilayer Ceramic Capacitor, 0.1 uF, 25 V, ± 10%, X7R, 0402 [1005 Metric]; Manufacturer: Yageo; Material: 4241ConductorMaterial; Voltage Rating: 16V; Temperature Coefficient: 30ppm/°C; Supplier: Future Electronics; Supplier Part Number: 8517856; Manufacturer Part Number: CC0402KRX7R7BB104; RoHS: Yes; Category: Ceramic Capacitors; Stock: 30330000; Pricing: 10000=0,0028, 40000=0,0027, 150000=0,0025, 300000=0,0025, 750000=0,0023 (USD); Mounting Technology: Surface Mount; Case/Package: 0402; Pins: 2; Case Code (Metric): 1005; Case Code (Imperial): 0402; Min Operating Temperature: -55°C; Max Operating Temperature: 125°C; Tolerance: 10%; Dielectric: X7R; Voltage Rating (DC): 16V; Packaging: Tape and Reel; Package Quantity: 1; Termination: SMD/SMT; Voltage: 16V; Series: CC; Voltage Rating (AC): 16V; Length: 1mm; Width: 0.02inch; Height: 0.5mm; Thickness: 0.022inch; Depth: 0.5mm; Radiation Hardening: No; RoHS Compliant: Yes; Reach SVHC Compliant: No; Halogen Free: 5694HalogenFree; Lead Free: 5697LeadFree; ComponentLink1URL: https://datasheet.ciiva.com/11788/0900766b80ce67ed-11788364.pdf?src-supplier=Rs; ComponentLink1Description: https://datasheet.ciiva.com/11788/0900766b80ce67ed-11788364.pdf?src-supplier=Rs; ComponentLink2URL: https://datasheet.ciiva.com/7978/1489800-7978111.pdf?src-supplier=Element14; ComponentLink2Description: https://datasheet.ciiva.com/7978/1489800-7978111.pdf?src-supplier=Element14; ComponentLink3URL: https://datasheet.ciiva.com/161/mlccorderingcode-161545.pdf?src-supplier=Digikey; ComponentLink3Description: https://datasheet.ciiva.com/161/mlccorderingcode-161545.pdf?src-supplier=Digikey; ComponentLink4URL: https://datasheet.ciiva.com/161/mlccorderingcode-161544.pdf?src-supplier=Digikey; ComponentLink4Description: https://datasheet.ciiva.com/161/mlccorderingcode-161544.pdf?src-supplier=Digikey; ComponentLink5URL: https://datasheet.ciiva.com/161/mlccorderingcode-161546.pdf?src-supplier=Digikey; ComponentLink5Description: https://datasheet.ciiva.com/161/mlccorderingcode-161546.pdf?src-supplier=Digikey; ComponentLink6URL: https://datasheet.ciiva.com/8033/1734573-8033661.pdf?src-supplier=Element14; ComponentLink6Description: https://datasheet.ciiva.com/8033/1734573-8033661.pdf?src-supplier=Element14; ComponentLink7URL: https://datasheet.ciiva.com/11587/upy-gphc-x7r-6-3v-to-50v-8-11587305.pdf?src-supplier=Avnet; ComponentLink7Description: https://datasheet.ciiva.com/11587/upy-gphc-x7r-6-3v-to-50v-8-11587305.pdf?src-supplier=Avnet; ComponentLink8URL: https://datasheet.ciiva.com/28450/1489800-28450335.pdf?src-supplier=Element14; ComponentLink8Description: https://datasheet.ciiva.com/28450/1489800-28450335.pdf?src-supplier=Element14; ComponentLink9URL: https://datasheet.ciiva.com/13395/upy-gphc-x7r-6-3v-to-50v-8-13395676.pdf?src-supplier=Mouser; ComponentLink9Description: https://datasheet.ciiva.com/13395/upy-gphc-x7r-6-3v-to-50v-8-13395676.pdf?src-supplier=Mouser; ComponentLink10URL: https://datasheet.ciiva.com/8033/1734573-8033663.pdf?src-supplier=Element14; ComponentLink10Description: https://datasheet.ciiva.com/8033/1734573-8033663.pdf?src-supplier=Element14
C5 C19 = CAP CER 20PF 50V C0G/NPO 0402: Manufacturer: Yageo; Temperature Coefficient: 30ppm/°C; Supplier: Future Electronics; Supplier Part Number: 9739384; Manufacturer Part Number: CC0402JRNPO9BN200; RoHS: Yes; Category: Ceramic Capacitors; Stock: 60000; Pricing: 10000=0,0025, 40000=0,0023, 150000=0,0022, 300000=0,0022, 750000=0,002 (USD); Halogen Free: 5694HalogenFree; ComponentLink1URL: https://datasheet.ciiva.com/176/mlccorderingcode-176360.pdf?src-supplier=Digikey; ComponentLink1Description: https://datasheet.ciiva.com/176/mlccorderingcode-176360.pdf?src-supplier=Digikey; ComponentLink2URL: https://datasheet.ciiva.com/176/mlccorderingcode-176361.pdf?src-supplier=Digikey; ComponentLink2Description: https://datasheet.ciiva.com/176/mlccorderingcode-176361.pdf?src-supplier=Digikey; ComponentLink3URL: https://datasheet.ciiva.com/176/mlccorderingcode-176362.pdf?src-supplier=Digikey; ComponentLink3Description: https://datasheet.ciiva.com/176/mlccorderingcode-176362.pdf?src-supplier=Digikey; ComponentLink4URL: https://datasheet.ciiva.com/7656/1132289-7656614.pdf?src-supplier=Element14; ComponentLink4Description: https://datasheet.ciiva.com/7656/1132289-7656614.pdf?src-supplier=Element14; ComponentLink5URL: https://datasheet.ciiva.com/5427/upy-gp-np0-16v-to-50v-8-3714-5427769.pdf?src-supplier=Mouser; ComponentLink5Description: https://datasheet.ciiva.com/5427/upy-gp-np0-16v-to-50v-8-3714-5427769.pdf?src-supplier=Mouser
C20 = CAP CER 1UF 25V X5R 0603: Multilayer Ceramic Capacitor, 1 uF, 25 V, ± 10%, X5R, 0603 [1608 Metric]; Manufacturer: Yageo; Material: 4241ConductorMaterial; Voltage Rating: 25V; Supplier: Future Electronics; Supplier Part Number: 5636071; Manufacturer Part Number: CC0603KRX5R8BB105; RoHS: Yes; Category: Ceramic Capacitors; Stock: 3696000; Pricing: 4000=0,0113, 16000=0,0107, 40000=0,0104, 100000=0,0101, 160000=0,0095 (USD); Mounting Technology: Surface Mount; Case/Package: 0603; Pins: 2; Case Code (Metric): 1608; Case Code (Imperial): 0603; Min Operating Temperature: -55°C; Max Operating Temperature: 85°C; Tolerance: 10%; Dielectric: X5R; Packaging: Tape and Reel; Termination: SMD/SMT; Series: CC; Construction: Flat; Voltage Rating (DC): 25V; Length: 1.6mm; Height: 0.8mm; Depth: 0.8mm; Radiation Hardening: No; Reach SVHC Compliant: No; RoHS Compliant: Yes; Halogen Free: 5694HalogenFree; Lead Free: 5697LeadFree; ComponentLink1URL: https://datasheet.ciiva.com/7978/1525783-7978171.pdf?src-supplier=Element14; ComponentLink1Description: https://datasheet.ciiva.com/7978/1525783-7978171.pdf?src-supplier=Element14; ComponentLink2URL: https://datasheet.ciiva.com/176/mlccorderingcode-176786.pdf?src-supplier=Digikey; ComponentLink2Description: https://datasheet.ciiva.com/176/mlccorderingcode-176786.pdf?src-supplier=Digikey; ComponentLink3URL: https://datasheet.ciiva.com/176/mlccorderingcode-176785.pdf?src-supplier=Digikey; ComponentLink3Description: https://datasheet.ciiva.com/176/mlccorderingcode-176785.pdf?src-supplier=Digikey; ComponentLink4URL: https://datasheet.ciiva.com/176/mlccorderingcode-176787.pdf?src-supplier=Digikey; ComponentLink4Description: https://datasheet.ciiva.com/176/mlccorderingcode-176787.pdf?src-supplier=Digikey; ComponentLink5URL: https://datasheet.ciiva.com/11586/upy-gphc-x5r-4v-to-50v-12-11586318.pdf?src-supplier=Avnet; ComponentLink5Description: https://datasheet.ciiva.com/11586/upy-gphc-x5r-4v-to-50v-12-11586318.pdf?src-supplier=Avnet
C21 C22 = CAP CER 2.2UF 16V X7R 1206: Surface Mount Ceramic Multilayer Capacitor 2.2uF 10% X7R 16V 1206 Blister T/R; Manufacturer: Yageo; Material: 4241ConductorMaterial; Supplier: Future Electronics; Supplier Part Number: 6606222; Manufacturer Part Number: CC1206KKX7R7BB225; RoHS: Yes; Category: Ceramic Capacitors; Stock: 141000; Pricing: 3000=0,0378, 9000=0,0363, 15000=0,0357, 30000=0,0348, 60000=0,0335 (USD); ComponentLink1URL: https://datasheet.ciiva.com/11788/0900766b80d84f1d-11788402.pdf?src-supplier=Rs; ComponentLink1Description: https://datasheet.ciiva.com/11788/0900766b80d84f1d-11788402.pdf?src-supplier=Rs; ComponentLink2URL: https://datasheet.ciiva.com/11466/upy-gphc-x7r-6-3v-to-50v-8-11466572.pdf?src-supplier=Avnet; ComponentLink2Description: https://datasheet.ciiva.com/11466/upy-gphc-x7r-6-3v-to-50v-8-11466572.pdf?src-supplier=Avnet; ComponentLink3URL: https://datasheet.ciiva.com/5425/upy-gphc-x7r-6-3v-to-50v-8-12304-5425499.pdf?src-supplier=Mouser; ComponentLink3Description: https://datasheet.ciiva.com/5425/upy-gphc-x7r-6-3v-to-50v-8-12304-5425499.pdf?src-supplier=Mouser
L1 = FB 300 OHMS @ 100 MHZ 1 POWER, SIGN: 500mA 1 350mΩ 300Ω@100MHz ±25% 0603 Ferrite Beads ROHS; Manufacturer: Tai Tech; Supplier: Digikey; Supplier Part Number: 4816-FCM1608KF-301T05CT-ND; Manufacturer Part Number: FCM1608KF-301T05; RoHS: No; Category: Ferrite Beads and Chips; Stock: 6740; Pricing: 1=0,1, 10=0,025, 25=0,0224, 50=0,0202, 100=0,0182, 250=0,01332, 500=0,0097, 1000=0,00949 (USD)
R1 = RES 510K OHM 1% 1/16W 0402: SMD Chip Resistor, 510 kOhm, ± 1%, 63 mW, 0402 [1005 Metric], Thick Film, General Purpose; Manufacturer: Yageo; Power Rating: 63mW; Voltage Rating: 50V; Temperature Coefficient: 100ppm/°C; Supplier: Future Electronics; Supplier Part Number: 2225407; Manufacturer Part Number: RC0402FR-07510KL; RoHS: Yes; Category: Chip SMD Resistors; Stock: 3670000; Pricing: 10000=0,0019, 100000=0,0011, 200000=0,0018, 300000=0,001, 750000=0,0017, 2000000=0,0017, 7500000=0,0015 (USD); Case/Package: 0402; Case Code (Imperial): 0402; Case Code (Metric): 1005; Min Operating Temperature: -55°C; Max Operating Temperature: 155°C; Tolerance: 1%; Packaging: Tape and Reel; Package Quantity: 1; Termination: SMD/SMT; Resistor Type: Thick Film; Number of Terminations: 2; Max Power Dissipation: 63mW; Features: Moisture Resistant; Series: RC; Construction: Rectangular; Resistance Tolerance: 1%; Technology: THICK FILM; Voltage Rating (DC): 50V; Length: 1mm; Width: 0.02inch; Height: 0.016inch; Depth: 0.5mm; Military Standard: Not; RoHS Compliant: Yes; Reach SVHC Compliant: Unknown; Lead Free: 5697LeadFree; ComponentLink1URL: https://datasheet.ciiva.com/11808/0900766b80c66297-11808810.pdf?src-supplier=Rs; ComponentLink1Description: https://datasheet.ciiva.com/11808/0900766b80c66297-11808810.pdf?src-supplier=Rs; ComponentLink2URL: https://datasheet.ciiva.com/2453/pyu-r-int-thick-7-2453464.pdf?src-supplier=Digikey; ComponentLink2Description: https://datasheet.ciiva.com/2453/pyu-r-int-thick-7-2453464.pdf?src-supplier=Digikey; ComponentLink3URL: https://datasheet.ciiva.com/2453/pyu-r-int-thick-7-2453463.pdf?src-supplier=Digikey; ComponentLink3Description: https://datasheet.ciiva.com/2453/pyu-r-int-thick-7-2453463.pdf?src-supplier=Digikey; ComponentLink4URL: https://datasheet.ciiva.com/17419/pyu-rc0402-51-rohs-l-6-r-17419596.pdf?src-supplier=Future+Electronics; ComponentLink4Description: https://datasheet.ciiva.com/17419/pyu-rc0402-51-rohs-l-6-r-17419596.pdf?src-supplier=Future+Electronics; ComponentLink5URL: https://datasheet.ciiva.com/2453/pyu-r-int-thick-7-2453465.pdf?src-supplier=Digikey; ComponentLink5Description: https://datasheet.ciiva.com/2453/pyu-r-int-thick-7-2453465.pdf?src-supplier=Digikey
R2 = RES 220 OHM 1% 1/16W 0402: SMD Chip Resistor, 220 Ohm, ± 1%, 63 mW, 0402 [1005 Metric], Thick Film, General Purpose; Manufacturer: Yageo; Power Rating: 62.5mW; Voltage Rating: 50V; Temperature Coefficient: 100ppm/°C; Max Power Dissipation: 63mW; Supplier: Future Electronics; Supplier Part Number: 4696860; Manufacturer Part Number: RC0402FR-07220RL; RoHS: Yes; Category: Chip SMD Resistors; Stock: 3710000; Pricing: 10000=0,0012, 100000=0,0011, 200000=0,0011, 300000=0,001, 750000=0,0011, 2000000=0,0009, 2500000=0,001, 10000000=0,0009 (USD); Case/Package: 0402; Pins: 2; Case Code (Imperial): 0402; Case Code (Metric): 1005; Min Operating Temperature: -55°C; Max Operating Temperature: 155°C; Tolerance: 1%; Packaging: Tape and Reel; Voltage Rating (DC): 50V; Package Quantity: 1; Termination: SMD/SMT; Resistor Type: Thick Film; Number of Terminations: 2; Features: Moisture Resistant; Series: RC; Resistance Tolerance: 1%; Construction: Rectangular; Technology: THICK FILM; Voltage Rating (AC): 50V; Length: 0.039inch; Width: 0.02inch; Height: 0.016inch; Depth: 0.5mm; Reach SVHC Compliant: No; Military Standard: Not; RoHS Compliant: Yes; Lead Free: 5697LeadFree; ComponentLink1URL: https://datasheet.ciiva.com/2453/pyu-r-int-thick-7-2453461.pdf?src-supplier=Digikey; ComponentLink1Description: https://datasheet.ciiva.com/2453/pyu-r-int-thick-7-2453461.pdf?src-supplier=Digikey
SB1-SB7 = RES 0 OHM JUMPER 1/10W 0603: Zero Ohm Resistor, Jumper, 0402 [1005 Metric], Thick Film, 62.5 mW, 1 A, Surface Mount; Manufacturer: Yageo; Manufacturer Part Number: RC0603JR-070RL; Tolerance: 1%; Power Rating: 100mW; Voltage Rating (DC): 50V; Temperature Coefficient: 200ppm/°C; Resistance Tolerance: 5%; Value: 0mR; Supplier: Future Electronics; Supplier Part Number: 3992146; RoHS: Yes; Category: Chip SMD Resistors; Stock: 16200000; Pricing: 5000=0,0016, 50000=0,0014, 100000=0,0015, 150000=0,0014, 375000=0,0014, 1000000=0,0012, 1250000=0,0013, 5000000=0,0012 (USD); Case/Package: 0603; Pins: 2; Contact Plating: Tin,Matte; Case Code (Imperial): 0402; Case Code (Metric): 1608; Min Operating Temperature: -55°C; Max Operating Temperature: 155°C; Resistor Type: Thick Film; Packaging: Tape and Reel; Termination: SMD/SMT; Series: RC; Technology: THICK FILM; Package Quantity: 5000; Voltage Rating: 50V; Features: Moisture Resistant; Max Power Dissipation: 100mW; Number of Terminations: 2; Construction: Rectangular; Length: 1.6mm; Width: 0.8mm; Height: 0.45mm; Depth: 0.8mm; RoHS Compliant: Yes; Reach SVHC Compliant: Unknown; Lead Free: 5697LeadFree; Military Standard: Not
U1 = IC MCU 32BIT 2MB FLASH 144LQFP: RISC Microcontroller, 32-Bit, FLASH, CORTEX-M4F CPU, 180MHz, CMOS, PQFP144; Manufacturer: STMicroelectronics; Density: 2MB; Nominal Supply Current: 1.7uA; Number of A/D Converters: 3NUMBER; Number of Channels: 24NUMBER; Number of D/A Converters: 2NUMBER; Supplier: Mouser; Supplier Part Number: 511-STM32F429ZIT6; Manufacturer Part Number: STM32F429ZIT6; RoHS: Yes; Category: Microcontrollers; Stock: 1510; Pricing: 1=18,06, 10=16,6, 50=15,92, 100=14,02, 1000=12,47, 10000=12,47 (USD); ComponentLink1URL: https://datasheet.ciiva.com/28647/1818195-28647943.pdf?src-supplier=Element14; ComponentLink1Description: https://datasheet.ciiva.com/28647/1818195-28647943.pdf?src-supplier=Element14; ComponentLink2URL: https://datasheet.ciiva.com/29987/dm00071990-29987273.pdf?src-supplier=Avnet; ComponentLink2Description: https://datasheet.ciiva.com/29987/dm00071990-29987273.pdf?src-supplier=Avnet; ComponentLink3URL: https://datasheet.ciiva.com/29722/dm00053488-29722151.pdf?src-supplier=Digikey; ComponentLink3Description: https://datasheet.ciiva.com/29722/dm00053488-29722151.pdf?src-supplier=Digikey
X1 = Crystal 8MHZ 20PF 20PPM H1OED8K5: HC-49US 8MHZ 20PF 20PPM H1OED8K5; Manufacturer: YXC; Equivalent Series Resistance: 60OHMs; ComponentLink1Description: Datasheet; ComponentLink1URL: https://mm.digikey.com/Volume0/opasdata/d220001/medias/docus/4129/HC-49US_Dip.pdf; Series: HC-49US; Frequency Stability: 20ppm; Load Capacitance: 20pF; Mounting Type: Through Hole; Height-Size-Dimension: 0.145" (3.68mm)-0.453" L x 0.177" W (11.50mm x 4.50mm)

## Sheet SDRAM.SchDoc
size 420 x 297 mm; Date: 22.03.2024; ApprovedBy: Arda B.; CheckedBy: Arda B.; DrawnBy: Arda Bozkurt; Revision: 001; SheetNumber: 5; SheetTotal: 9; Size: A3; Department: HDD; DOC_NO_ASSY_: __; Time: 22.03.2024
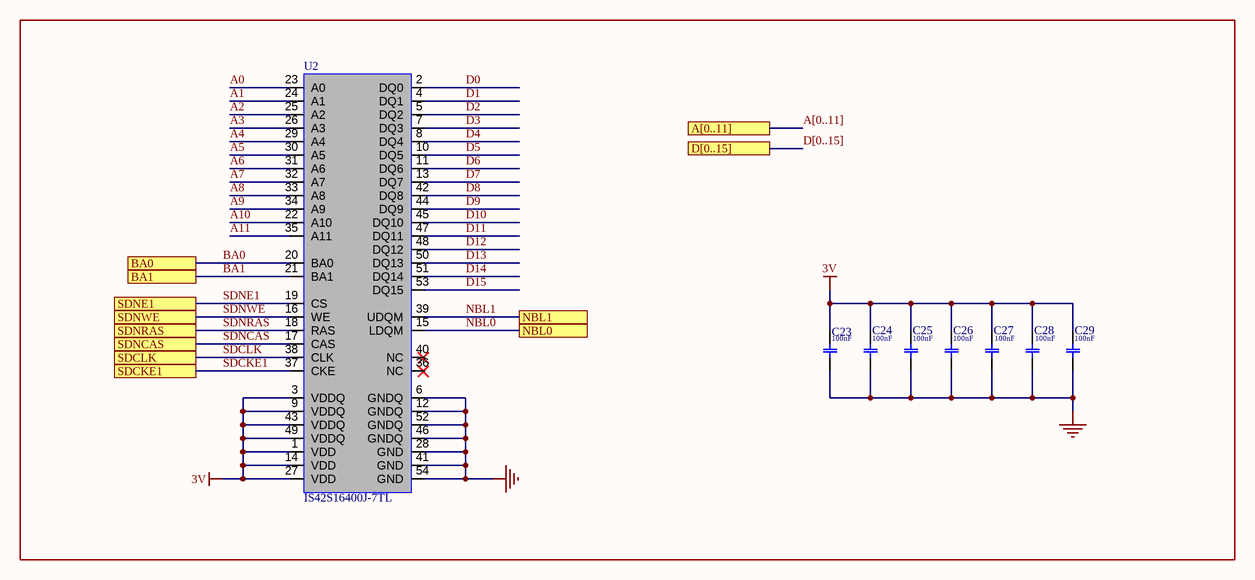
[diagram p4: SDRAM.SchDoc]

### Parts
C23  value 100nF  [CAP-0402]  (hidden comment: CC0402KRX7R7BB104)
C24  value 100nF  [CAP-0402]  (hidden comment: CC0402KRX7R7BB104)
C25  value 100nF  [CAP-0402]  (hidden comment: CC0402KRX7R7BB104)
C26  value 100nF  [CAP-0402]  (hidden comment: CC0402KRX7R7BB104)
C27  value 100nF  [CAP-0402]  (hidden comment: CC0402KRX7R7BB104)
C28  value 100nF  [CAP-0402]  (hidden comment: CC0402KRX7R7BB104)
C29  value 100nF  [CAP-0402]  (hidden comment: CC0402KRX7R7BB104)
U2  IS42S16400J-7TL  [54-TSOP]

### Ports
A[0..11] (see TOP[3A], Micro Controller[4B]), BA0 (see TOP[3A], Micro Controller[5A]), BA1 (see TOP[3A], Micro Controller[5A]), D[0..15] (see TOP[3A], Micro Controller[4B]), NBL0 (see TOP[3A], Micro Controller[5A]), NBL1 (see TOP[3A], Micro Controller[5A]), SDCKE1 (see TOP[3A], Micro Controller[5A]), SDCLK (see TOP[3A], Micro Controller[5A]), SDNCAS (see TOP[3A], Micro Controller[5A]), SDNE1 (see TOP[3A], Micro Controller[5A]), SDNRAS (see TOP[3A], Micro Controller[5A]), SDNWE (see TOP[3A], Micro Controller[5A])

### Nets
3V: C23.2 C24.2 C25.2 C26.2 C27.2 C28.2 C29.2 U2.1(VDD) U2.3(VDDQ) U2.9(VDDQ) U2.14(VDD) U2.27(VDD) U2.43(VDDQ) U2.49(VDDQ)
GND: C23.1 C24.1 C25.1 C26.1 C27.1 C28.1 C29.1 U2.6(GNDQ) U2.12(GNDQ) U2.28(GND) U2.41(GND) U2.46(GNDQ) U2.52(GNDQ) U2.54(GND)
A0: U2.23(A0)
A1: U2.24(A1)
A2: U2.25(A2)
A3: U2.26(A3)
A4: U2.29(A4)
A5: U2.30(A5)
A6: U2.31(A6)
A7: U2.32(A7)
A8: U2.33(A8)
A9: U2.34(A9)
A10: U2.22(A10)
A11: U2.35(A11)
BA0: U2.20(BA0) ; port BA0
BA1: U2.21(BA1) ; port BA1
D0: U2.2(DQ0)
D1: U2.4(DQ1)
D2: U2.5(DQ2)
D3: U2.7(DQ3)
D4: U2.8(DQ4)
D5: U2.10(DQ5)
D6: U2.11(DQ6)
D7: U2.13(DQ7)
D8: U2.42(DQ8)
D9: U2.44(DQ9)
D10: U2.45(DQ10)
D11: U2.47(DQ11)
D12: U2.48(DQ12)
D13: U2.50(DQ13)
D14: U2.51(DQ14)
D15: U2.53(DQ15)
NBL0: U2.15(LDQM) ; port NBL0
NBL1: U2.39(UDQM) ; port NBL1
SDCKE1: U2.37(CKE) ; port SDCKE1  [project net PB5]
SDCLK: U2.38(CLK) ; port SDCLK  [project net PG8]
SDNCAS: U2.17(CAS) ; port SDNCAS  [project net PG15]
SDNE1: U2.19(CS) ; port SDNE1  [project net PB6]
SDNRAS: U2.18(RAS) ; port SDNRAS  [project net PF11]
SDNWE: U2.16(WE) ; port SDNWE  [project net PC0]

Not connected (* = marked no-connect by the designer): U2 36(NC) 40(NC)

### Buses and harness runs
bus A[0..11] = port A[0..11]
bus D[0..15] = port D[0..15]

### Notes on the sheet
- REVİSİON
- DESCRIPTION
- DATE
- APPROVED
- DWG NO:
- TAINIM/DESCRIPTION
- REV:
- DOSYA ADI/FİLE NAME
- HAZIRLAYAN/PREPARED BY
- KONTROL EDEN/ CHECKED BY
- YAYIN TARİHİ/REL. DATE
- DEĞ TARİHİ/CHANCE DATE
- ONAYLAYAN/APPROVED BY
- REVİZYON/REVISION
- Arda Bozkurt
- BÖLÜM/DEPARTMENT
- BOYUT/SİZE
- SAYFA/SHEET
- of

### Library data of the parts
C23-C29 = CAP CER 100nF 16V X7R 0402: as C2 on sheet Micro Controller; Supplier: Future Electronics; Supplier Part Number: 8517856; Manufacturer Part Number: CC0402KRX7R7BB104; RoHS: Yes; Category: Ceramic Capacitors; Stock: 30330000; Pricing: 10000=0,0028, 40000=0,0027, 150000=0,0025, 300000=0,0025, 750000=0,0023 (USD); Mounting Technology: Surface Mount; Case/Package: 0402; Pins: 2; Case Code (Metric): 1005; Case Code (Imperial): 0402; Min Operating Temperature: -55°C; Max Operating Temperature: 125°C; Tolerance: 10%; Dielectric: X7R; Voltage Rating (DC): 16V; Packaging: Tape and Reel; Package Quantity: 1; Termination: SMD/SMT; Voltage: 16V; Series: CC; Voltage Rating (AC): 16V; Length: 1mm; Width: 0.02inch; Height: 0.5mm; Thickness: 0.022inch; Depth: 0.5mm; Radiation Hardening: No; RoHS Compliant: Yes; Reach SVHC Compliant: No; Halogen Free: 5694HalogenFree; Lead Free: 5697LeadFree; ComponentLink1URL: https://datasheet.ciiva.com/11788/0900766b80ce67ed-11788364.pdf?src-supplier=Rs; ComponentLink1Description: https://datasheet.ciiva.com/11788/0900766b80ce67ed-11788364.pdf?src-supplier=Rs; ComponentLink2URL: https://datasheet.ciiva.com/7978/1489800-7978111.pdf?src-supplier=Element14; ComponentLink2Description: https://datasheet.ciiva.com/7978/1489800-7978111.pdf?src-supplier=Element14; ComponentLink3URL: https://datasheet.ciiva.com/161/mlccorderingcode-161545.pdf?src-supplier=Digikey; ComponentLink3Description: https://datasheet.ciiva.com/161/mlccorderingcode-161545.pdf?src-supplier=Digikey; ComponentLink4URL: https://datasheet.ciiva.com/161/mlccorderingcode-161544.pdf?src-supplier=Digikey; ComponentLink4Description: https://datasheet.ciiva.com/161/mlccorderingcode-161544.pdf?src-supplier=Digikey; ComponentLink5URL: https://datasheet.ciiva.com/161/mlccorderingcode-161546.pdf?src-supplier=Digikey; ComponentLink5Description: https://datasheet.ciiva.com/161/mlccorderingcode-161546.pdf?src-supplier=Digikey; ComponentLink6URL: https://datasheet.ciiva.com/8033/1734573-8033661.pdf?src-supplier=Element14; ComponentLink6Description: https://datasheet.ciiva.com/8033/1734573-8033661.pdf?src-supplier=Element14; ComponentLink7URL: https://datasheet.ciiva.com/11587/upy-gphc-x7r-6-3v-to-50v-8-11587305.pdf?src-supplier=Avnet; ComponentLink7Description: https://datasheet.ciiva.com/11587/upy-gphc-x7r-6-3v-to-50v-8-11587305.pdf?src-supplier=Avnet; ComponentLink8URL: https://datasheet.ciiva.com/28450/1489800-28450335.pdf?src-supplier=Element14; ComponentLink8Description: https://datasheet.ciiva.com/28450/1489800-28450335.pdf?src-supplier=Element14; ComponentLink9URL: https://datasheet.ciiva.com/13395/upy-gphc-x7r-6-3v-to-50v-8-13395676.pdf?src-supplier=Mouser; ComponentLink9Description: https://datasheet.ciiva.com/13395/upy-gphc-x7r-6-3v-to-50v-8-13395676.pdf?src-supplier=Mouser; ComponentLink10URL: https://datasheet.ciiva.com/8033/1734573-8033663.pdf?src-supplier=Element14; ComponentLink10Description: https://datasheet.ciiva.com/8033/1734573-8033663.pdf?src-supplier=Element14
U2 = IC DRAM 64MBIT PAR 54TSOP II: PTC Resettable Fuse 2A(hold) 4A(trip) 16VDC 100A 1.5W 4.5s 0.035Ohm SMD Solder Pad 7.98 X 5.44 X 0.9mm T/R; Manufacturer: Bel; Manufacturer Part Number: 0ZCF0200AF2C; Time to Trip: 5s; Voltage Rating: 24V; Supplier: Mouser; Supplier Part Number: 530-0ZCF0200AF2C; RoHS: Yes; Category: PTC Resettable Fuses; Stock: 47794; Pricing: 1=0,27, 10=0,222, 50=0,222, 100=0,198, 1000=0,166, 10000=0,113 (USD); Mounting Technology: Surface Mount; Case/Package: 448Case; Case Code (Metric): 7351; Case Code (Imperial): 2920; Min Operating Temperature: -40°C; Max Operating Temperature: 85°C; Packaging: Cut Tape; Series: 0ZCF; Max Current Rating: 100A; Hold Current: 2A; Trip Current: 4A; Current Rating: 100A; Height: 800um; RoHS Compliant: Yes; Lead Free: Lead Free; ComponentLink1URL: https://datasheet.ciiva.com/18550/0zcf-18550655.pdf?src-supplier=Digikey; ComponentLink1Description: https://datasheet.ciiva.com/18550/0zcf-18550655.pdf?src-supplier=Digikey